# Altium schematic sheet RT9193.SchDoc
size A4
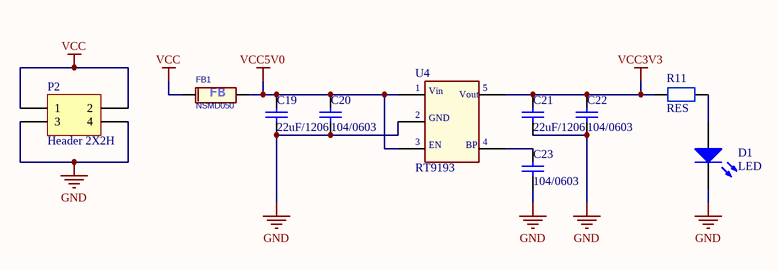
[diagram p0: RT9193.SchDoc]

## Parts
C19  22uF/1206  [C1206]
C20  104/0603  [C1206]
C21  22uF/1206  [C1206]
C22  104/0603  [C1206]
C23  104/0603  [C1206]
D1  LED  [LED0805]
FB1  NSMD050  [R1206]
P2  Header 2X2H  [HDR2X2H]
R11  RES  [R0603]
U4  RT9193  [SOT-23-5]

## Nets
GND: C19.1 C20.1 C21.1 C22.1 C23.1 D1.1(K) P2.3 P2.4 U4.2(GND)
VCC: FB1.1 P2.1 P2.2
VCC3V3: C21.2 C22.2 R11.2 U4.5(Vout)
VCC5V0: C19.2 C20.2 FB1.2 U4.1(Vin) U4.3(SHDN)
NetC23_2: C23.2 U4.4(BP)
NetD1_2: D1.2(A) R11.1

## Notes on the sheet
- (in symbol RT9193) EN

## Library data of the parts
C19-C23 = CAP: 无极性贴片电容
FB1 = FB: Ferrite Beads Inductors Impedance:120Ω±25% Rated Current:1500mA DC Resistance:0.095Ω; Manufacturer: muRata; Manufacturer Part Number: BLM15EG121SN1
P2 = Header 2X2H: Header, 2-Pin, Dual row, Right Angle; LatestRevisionDate: 17-Jul-2002; LatestRevisionNote: Re-released for DXP Platform.; Publisher: Altium Limited
U4 = RT9193: RT9193-1.2, RT9193-1.8, RT9193-3.3